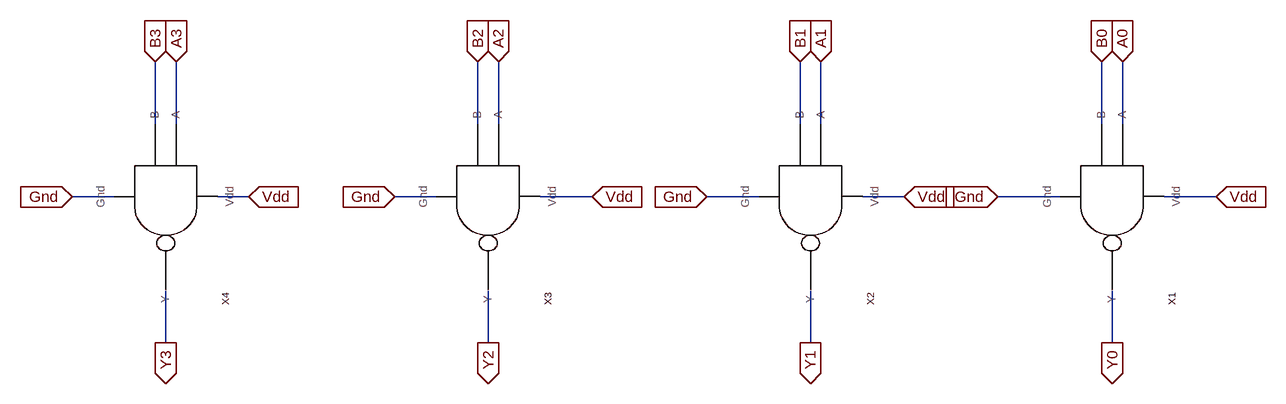
[diagram p0: schematic ALU_NAND.asc]
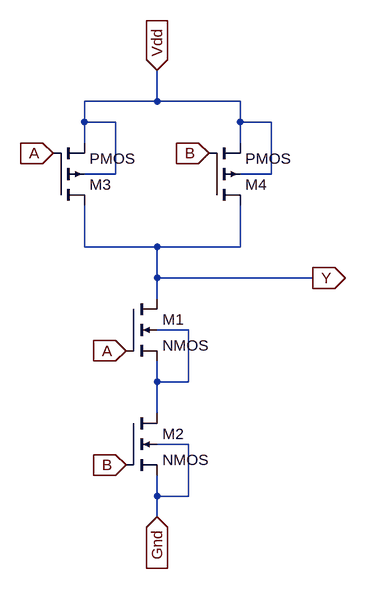
[diagram p1: sub-circuit nand.asc]
ALU_NAND.asc, the LTspice schematic file:
Version 4
SHEET 1 1000 680
WIRE -736 0 -736 -96
WIRE -704 0 -704 -96
WIRE -240 0 -240 -96
WIRE -208 0 -208 -96
WIRE 256 0 256 -96
WIRE 288 0 288 -96
WIRE 720 0 720 -96
WIRE 752 0 752 -96
WIRE -800 112 -864 112
WIRE -592 112 -640 112
WIRE -304 112 -368 112
WIRE -64 112 -144 112
WIRE 192 112 112 112
WIRE 416 112 352 112
WIRE 656 112 560 112
WIRE 896 112 816 112
WIRE -720 336 -720 256
WIRE -224 336 -224 256
WIRE 272 336 272 256
WIRE 736 336 736 256
FLAG 736 336 Y0
IOPIN 736 336 Out
FLAG 272 336 Y1
IOPIN 272 336 Out
FLAG -224 336 Y2
IOPIN -224 336 Out
FLAG -720 336 Y3
IOPIN -720 336 Out
FLAG 752 -96 A0
IOPIN 752 -96 In
FLAG 288 -96 A1
IOPIN 288 -96 In
FLAG -208 -96 A2
IOPIN -208 -96 In
FLAG -704 -96 A3
IOPIN -704 -96 In
FLAG 720 -96 B0
IOPIN 720 -96 In
FLAG 256 -96 B1
IOPIN 256 -96 In
FLAG -240 -96 B2
IOPIN -240 -96 In
FLAG -736 -96 B3
IOPIN -736 -96 In
FLAG -592 112 Vdd
IOPIN -592 112 In
FLAG -64 112 Vdd
IOPIN -64 112 In
FLAG 416 112 Vdd
IOPIN 416 112 In
FLAG 896 112 Vdd
IOPIN 896 112 In
FLAG 560 112 Gnd
IOPIN 560 112 In
FLAG 112 112 Gnd
IOPIN 112 112 In
FLAG -368 112 Gnd
IOPIN -368 112 In
FLAG -864 112 Gnd
IOPIN -864 112 In
SYMBOL nand 752 112 R90
SYMATTR InstName X1
SYMBOL nand 288 112 R90
SYMATTR InstName X2
SYMBOL nand -208 112 R90
SYMATTR InstName X3
SYMBOL nand -704 112 R90
SYMATTR InstName X4

nand.asc, the sub-circuit schematic file:
Version 4
SHEET 1 880 680
WIRE 192 -176 192 -224
WIRE 192 -176 80 -176
WIRE 320 -176 192 -176
WIRE 80 -144 80 -176
WIRE 128 -144 80 -144
WIRE 320 -144 320 -176
WIRE 368 -144 320 -144
WIRE 80 -112 80 -144
WIRE 320 -112 320 -144
WIRE 128 -64 128 -144
WIRE 128 -64 80 -64
WIRE 368 -64 368 -144
WIRE 368 -64 320 -64
WIRE 80 48 80 -16
WIRE 192 48 80 48
WIRE 320 48 320 -16
WIRE 320 48 192 48
WIRE 192 96 192 48
WIRE 432 96 192 96
WIRE 192 128 192 96
WIRE 240 176 192 176
WIRE 192 256 192 224
WIRE 240 256 240 176
WIRE 240 256 192 256
WIRE 192 304 192 256
WIRE 240 352 192 352
WIRE 192 432 192 400
WIRE 240 432 240 352
WIRE 240 432 192 432
WIRE 192 464 192 432
FLAG 192 464 Gnd
IOPIN 192 464 In
FLAG 144 384 B
IOPIN 144 384 In
FLAG 144 208 A
IOPIN 144 208 In
FLAG 32 -96 A
IOPIN 32 -96 In
FLAG 272 -96 B
IOPIN 272 -96 In
FLAG 432 96 Y
IOPIN 432 96 Out
FLAG 192 -224 Vdd
IOPIN 192 -224 In
SYMBOL nmos4 144 128 R0
SYMATTR InstName M1
SYMBOL nmos4 144 304 R0
SYMATTR InstName M2
SYMBOL pmos4 32 -16 M180
SYMATTR InstName M3
SYMBOL pmos4 272 -16 M180
SYMATTR InstName M4

The netlist it stands for:
* ALU_NAND.asc
XX1 A0 B0 Vdd Gnd Y0 nand
XX2 A1 B1 Vdd Gnd Y1 nand
XX3 A2 B2 Vdd Gnd Y2 nand
XX4 A3 B3 Vdd Gnd Y3 nand

* block symbol definitions
.subckt nand A B Vdd Gnd Y
M1 Y A N001 N001 NMOS
M2 N001 B Gnd Gnd NMOS
M3 Y A Vdd Vdd PMOS
M4 Y B Vdd Vdd PMOS
.ends nand

.model NMOS NMOS
.model PMOS PMOS
.lib standard.mos
.backanno
.end